# EAGLE design sensor (EAGLE 7.5.0)
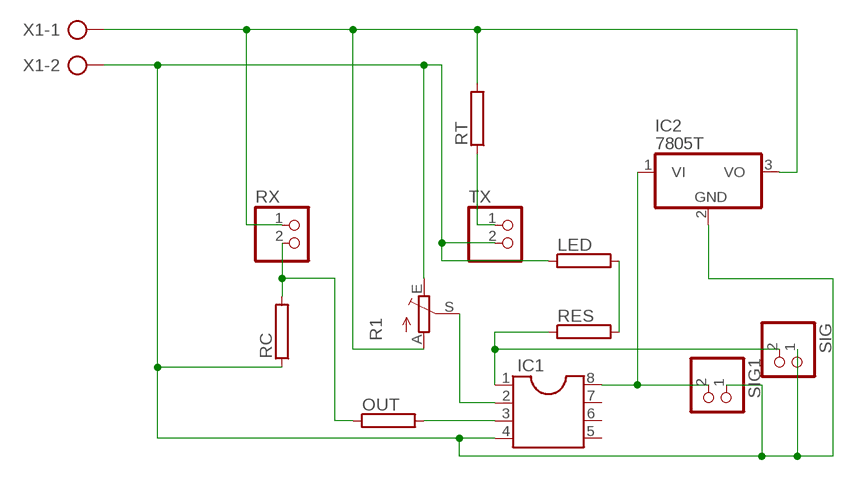
[diagram p0: schematic, sheet 1]

## Parts
IC1  DIL8  [DIL08]
IC2  7805T  [TO220H]
LED  RKH208-8R  [KH208R-8]
OUT  RKH208-8R  [KH208R-8]
R1  TRIM_EU-CA6V  [CA6V]
RC  RKH208-8R  [KH208R-8]
RES  RKH208-8R  [KH208R-8]
RT  RKH208-8R  [KH208R-8]
RX  PINHD-1X2  [1X02]
SIG  PINHD-1X2  [1X02]
SIG1  PINHD-1X2  [1X02]
TX  PINHD-1X2  [1X02]
X1  AK500/2-H  [AK500/2-H]

## Nets
N$1: RT.1 TX.1
N$2: IC2.3(VO) R1.A RT.2 RX.1 X1.1
N$3: IC1.4 IC2.2(GND) LED.1 R1.E RC.1 SIG1.1 SIG.1 TX.2 X1.2
N$4: OUT.1 RC.2 RX.2
N$5: IC1.8 IC2.1(VI) SIG1.2
N$6: IC1.3 OUT.2
N$7: IC1.2 R1.S
N$8: IC1.1 RES.1 SIG.2
N$9: LED.2 RES.2
Unconnected: IC1.5 IC1.6 IC1.7

## Library data of the parts
IC1 = ic-package:DIL8: Dual In Line / Socket
IC2 = linear:78*: Positive VOLTAGE REGULATOR Source: http://cache.national.com/ds/LM/LM78L05.pdf http://www.fairchildsemi.com/ds/LM/LM7805.pdf
LED OUT RC RES RT = resistor-power:R: Power Resitor; OC_FARNELL: unknown; OC_NEWARK: unknown
R1 = pot:TRIM_EU-: POTENTIOMETER
RX SIG SIG1 TX = pinhead:PINHD-1X2: PIN HEADER
X1 = con-ptr500:AK500/2-H: CONNECTOR Aug. 2004 / PTR Meßtechnik: Die Bezeichnung der Serie AK505 wurde geändert. Es handelt sich hierbei um AK500 in horizontaler Ausführung.; OC_FARNELL: unknown; OC_NEWARK: unknown

## Board
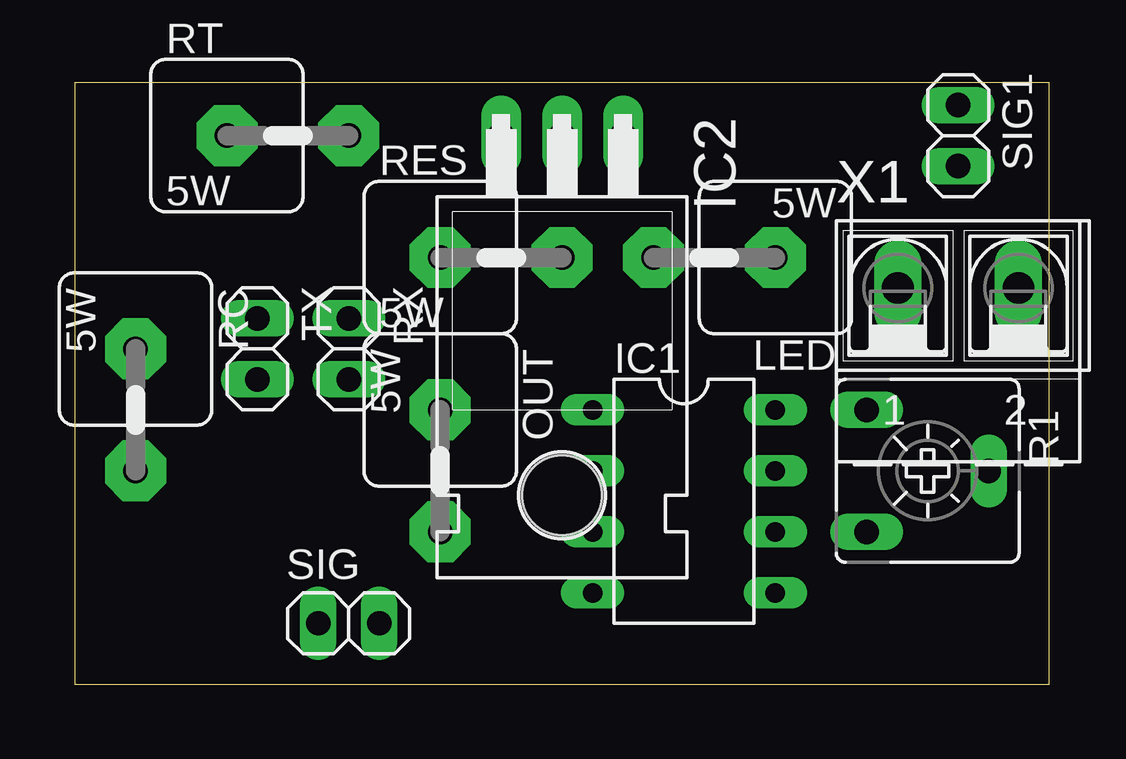
[diagram p1: board, top side]
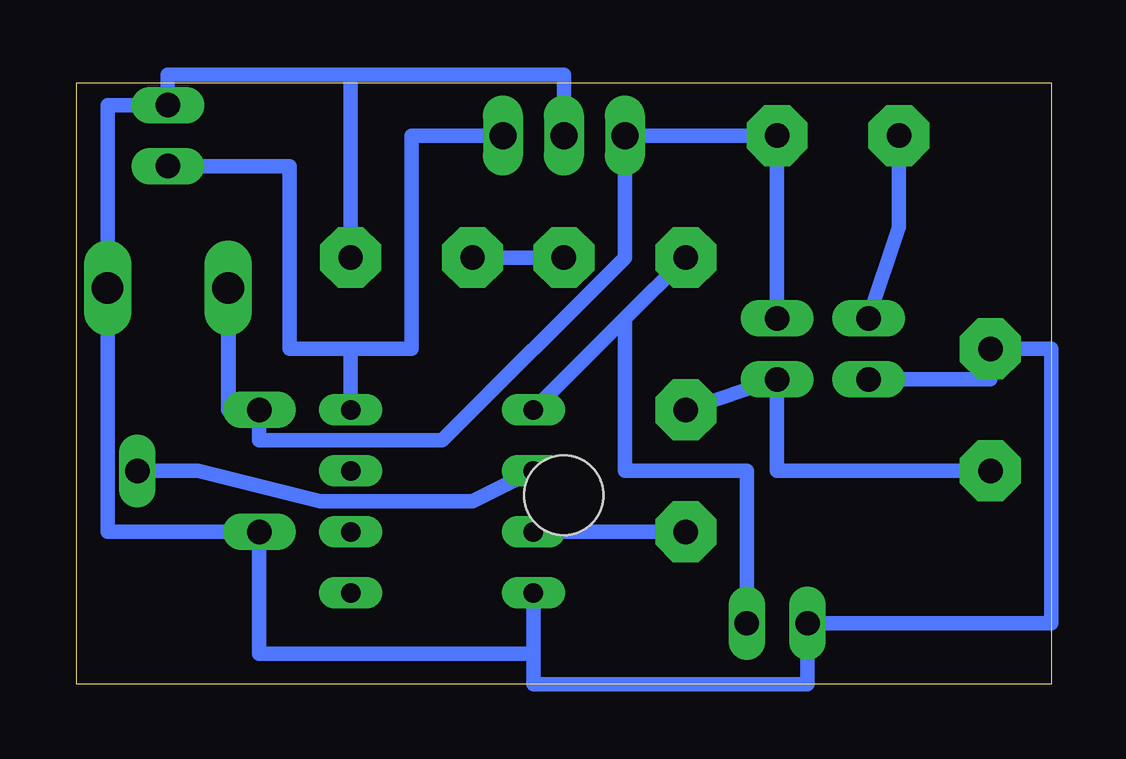
[diagram p2: board, bottom side, seen from below]

Size 40.62 x 25.07 mm. Coordinates in mm from the lower left corner, seen from the top.
Outline: 0,0 40.62,0 40.62,25.07 0,25.07 0,0
Copper layers (1*16): Top 0.035mm / dielectric 1.5mm / Bottom 0.035mm
Design rules "default": minimum track width 10mil, minimum drill 24mil, track to track 8mil, track to pad 8mil, pad to pad 8mil, via to via 8mil, smd to smd 8mil, copper to edge 40mil, drill to drill 8mil, minimum pad ring 10mil, minimum via ring 8mil, stop-mask expansion 4mil, vias tented up to drill 0mil, thermal gap 10mil

### Footprints (pad centres in the part's own frame; a part is rotated, then mirrored left to right if it is on the bottom)
DIL08 = drill 0.813 long: 1 -3.81,-3.81; 2 -1.27,-3.81; 3 1.27,-3.81; 4 3.81,-3.81; 5 3.81,3.81; 6 1.27,3.81; 7 -1.27,3.81; 8 -3.81,3.81
TO220H = drill 1.118 long: 1 -2.54,-10.16; 2 0,-10.16; 3 2.54,-10.16 | hole 3.302: 0,4.826
KH208R-8 = drill 1.016 pad 2.54 octagon: 1 -2.54,0; 2 2.54,0
CA6V = drill 1.016 long: A -2.54,-2.54; E 2.54,-2.54; S 0,2.54
1X02 = drill 1.016 long: 1 -1.27,0; 2 1.27,0
AK500/2-H = drill 1.321 long: 1 -2.515,0; 2 2.515,0

### Placement (x,y rotation side)
IC1  25.4,7.62 270 top
IC2  20.32,12.7 180 top
LED  26.67,17.78 180 top
OUT  15.24,8.89 270 top
R1  35.56,8.89 270 top
RC  2.54,11.43 270 top
RES  17.78,17.78 0 top
RT  8.89,22.86 0 top
RX  11.43,13.97 270 top
SIG  11.43,2.54 0 top
SIG1  36.83,22.86 270 top
TX  7.62,13.97 270 top
X1  36.83,16.51 0 top

### Tracks (layer width: path | path; a pad name or v marks a point on that pad's centre or on a via)
N$1
  Bottom 0.61: TX.1 6.35,19.05 RT.1
N$2
  Bottom 0.61: RX.1 RT.2 IC2.3 17.78,17.78 25.4,10.16 33.02,10.16 R1.A 34.29,11.43 | 34.29,11.43 34.31,11.43 X1.1 34.29,16.51 34.29,11.43
N$3
  Bottom 0.61: TX.2 2.54,12.7 RC.1 0,13.97 0,2.54 SIG.1 10.16,0 21.59,0 21.59,1.27 | 21.59,1.27 IC1.4 | 21.59,1.27 33.02,1.27 R1.E 39.34,6.35 X1.2 39.34,24.13 SIG1.1 36.83,25.4 29.21,25.4 | IC2.2 20.32,25.4 29.21,25.4 | LED.1 29.21,25.4
N$4
  Bottom 0.61: OUT.1 RX.2 11.43,8.89 RC.2
N$5
  Bottom 0.61: SIG1.2 31.75,21.59 31.75,13.97 29.21,13.97 | 29.21,13.97 IC1.8 | IC2.1 26.67,22.86 26.67,13.97 29.21,13.97
N$6
  Bottom 0.61: OUT.2 IC1.3
N$7
  Bottom 0.61: R1.S 35.56,8.89 30.48,7.62 24.13,7.62 IC1.2
N$8
  Bottom 0.61: IC1.1 17.78,15.24 | 17.78,15.24 RES.1 | SIG.2 12.7,8.89 17.78,8.89 17.78,15.24
N$9
  Bottom 0.61: LED.2 RES.2